# Altium project Main_board.PrjPcb
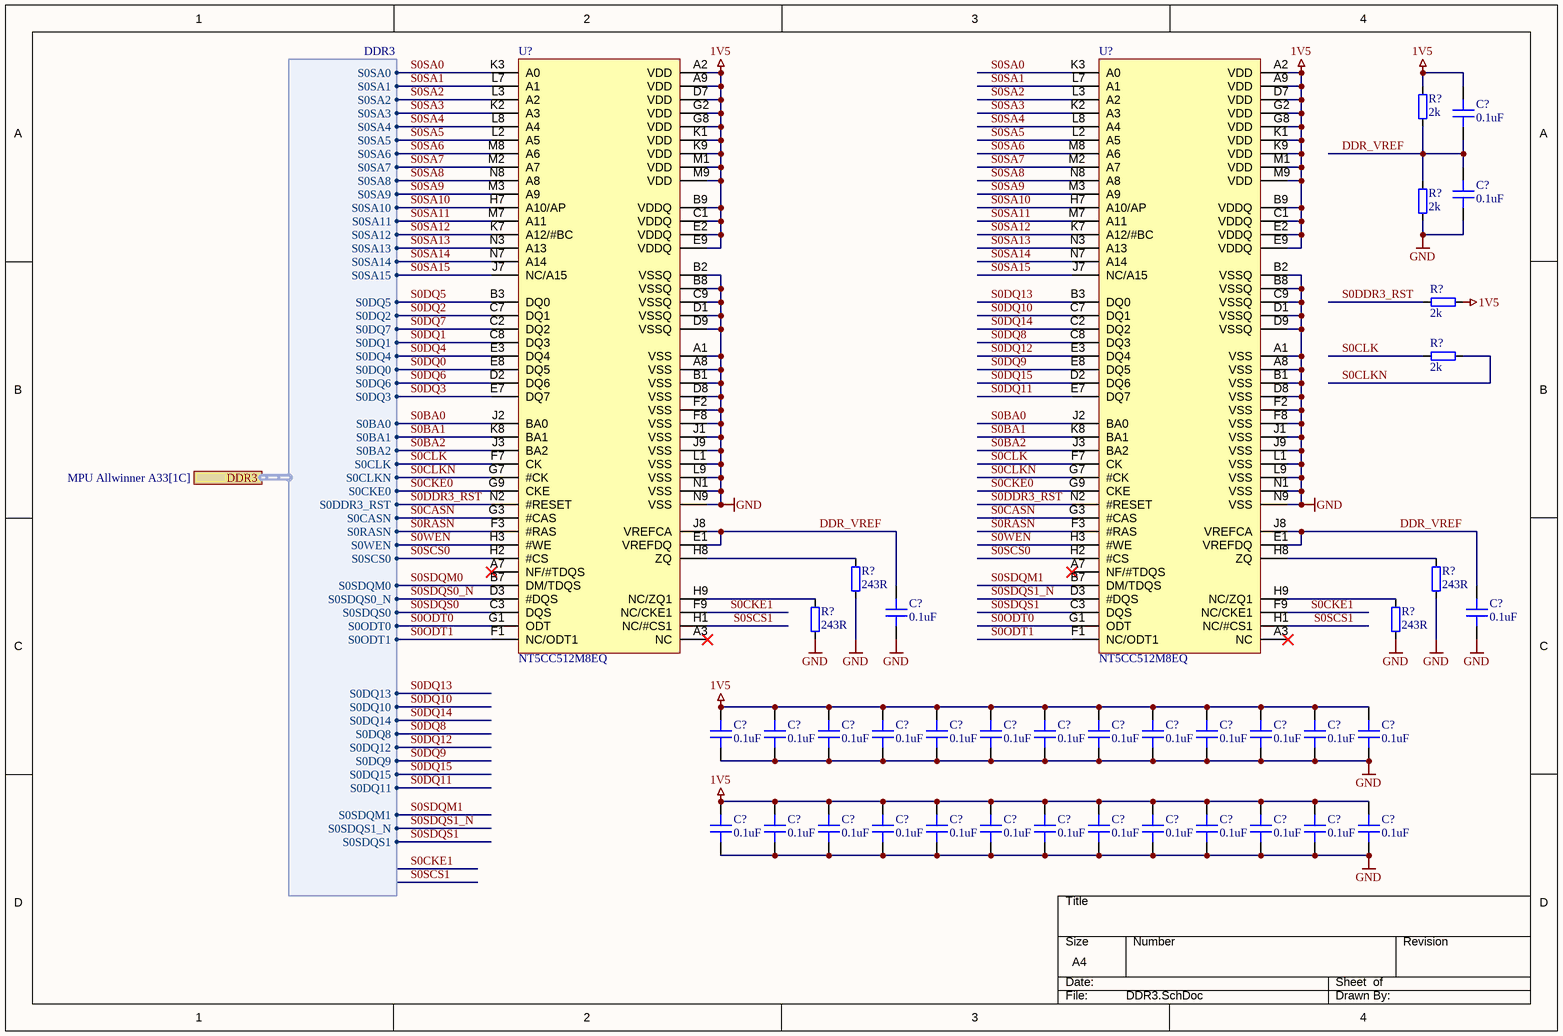
[diagram p0: DDR3.SchDoc]
11 sheets, 96 parts. Net scope: flat (ports and power ports of the same name join across sheets).
Board file: Main_board.PcbDoc
Sheets:
  Top level.SchDoc
  DDR3.SchDoc
  Micro SD.SchDoc
  NAND flash.SchDoc
  Wi-Fi AP6212.SchDoc
  PMIC AXP223.SchDoc
  CAN bus XL2515.SchDoc
  MPU Allwinner A33.SchDoc
  USB HUB FE1.1.SchDoc
  USB-Ethernet 100M SR9900A.SchDoc
  MCU HC32F460KETA.SchDoc

## Sheet Top level.SchDoc
size A4; SheetNumber: 5; SheetTotal: 5

## Sheet DDR3.SchDoc
size A4; SheetNumber: 3; SheetTotal: 9

### Parts
(Parts that share a designator on the sheet are numbered #1, #2 ... from top to bottom, then left to right.)
C?#1  0.1uF  [CAPC1005X06N]
C?#2  0.1uF  [CAPC1005X06N]
C?#3  0.1uF  [CAPC1005X06N]
C?#4  0.1uF  [CAPC1005X06N]
C?#5  0.1uF  [CAPC1005X06N]
C?#6  0.1uF  [CAPC1005X06N]
C?#7  0.1uF  [CAPC1005X06N]
C?#8  0.1uF  [CAPC1005X06N]
C?#9  0.1uF  [CAPC1005X06N]
C?#10  0.1uF  [CAPC1005X06N]
C?#11  0.1uF  [CAPC1005X06N]
C?#12  0.1uF  [CAPC1005X06N]
C?#13  0.1uF  [CAPC1005X06N]
C?#14  0.1uF  [CAPC1005X06N]
C?#15  0.1uF  [CAPC1005X06N]
C?#16  0.1uF  [CAPC1005X06N]
C?#17  0.1uF  [CAPC1005X06N]
C?#18  0.1uF  [CAPC1005X06N]
C?#19  0.1uF  [CAPC1005X06N]
C?#20  0.1uF  [CAPC1005X06N]
C?#21  0.1uF  [CAPC1005X06N]
C?#22  0.1uF  [CAPC1005X06N]
C?#23  0.1uF  [CAPC1005X06N]
C?#24  0.1uF  [CAPC1005X06N]
C?#25  0.1uF  [CAPC1005X06N]
C?#26  0.1uF  [CAPC1005X06N]
C?#27  0.1uF  [CAPC1005X06N]
C?#28  0.1uF  [CAPC1005X06N]
C?#29  0.1uF  [CAPC1005X06N]
C?#30  0.1uF  [CAPC1005X06N]
R?#1  2k  [RESC1005X35N]
R?#2  2k  [RESC1005X35N]
R?#3  2k  [RESC1005X35N]
R?#4  2k  [RESC1005X35N]
R?#5  243R  [RESC1005X35N]
R?#6  243R  [RESC1005X35N]
R?#7  243R  [RESC1005X35N]
R?#8  243R  [RESC1005X35N]
U?#1  NT5CC512M8EQ  [BGA78C80P9X13_800X1050X120]
U?#2  NT5CC512M8EQ  [BGA78C80P9X13_800X1050X120]

### Ports
DDR3 (harness DDR3, see MPU Allwinner A33[1C])

### Harnesses
DDR3: S0SA0, S0SA1, S0SA2, S0SA3, S0SA4, S0SA5, S0SA6, S0SA7, S0SA8, S0SA9, S0SA10, S0SA11, S0SA12, S0SA13, S0SA14, S0SA15, S0DQ5, S0DQ2, S0DQ7, S0DQ1, S0DQ4, S0DQ0, S0DQ6, S0DQ3, S0BA0, S0BA1, S0BA2, S0CLK, S0CLKN, S0CKE0, S0DDR3_RST, S0CASN, S0RASN, S0WEN, S0SCS0, S0SDQM0, S0SDQS0_N, S0SDQS0, S0ODT0, S0ODT1, S0DQ13, S0DQ10, S0DQ14, S0DQ8, S0DQ12, S0DQ9, S0DQ15, S0DQ11, S0SDQM1, S0SDQS1_N, S0SDQS1

### Nets
1V5: C?#1.1 C?#5.1 C?#6.1 C?#7.1 C?#8.1 C?#9.1 C?#10.1 C?#11.1 C?#12.1 C?#13.1 C?#14.1 C?#15.1 C?#16.1 C?#17.1 C?#18.1 C?#19.1 C?#20.1 C?#21.1 C?#22.1 C?#23.1 C?#24.1 C?#25.1 C?#26.1 C?#27.1 C?#28.1 C?#29.1 C?#30.1 R?#1.1 R?#3.2 U?#1.A2(VDD) U?#1.A9(VDD) U?#1.B9(VDDQ) U?#1.C1(VDDQ) U?#1.D7(VDD) U?#1.E2(VDDQ) U?#1.E9(VDDQ) U?#1.G2(VDD) U?#1.G8(VDD) U?#1.K1(VDD) U?#1.K9(VDD) U?#1.M1(VDD) U?#1.M9(VDD) U?#2.A2(VDD) U?#2.A9(VDD) U?#2.B9(VDDQ) U?#2.C1(VDDQ) U?#2.D7(VDD) U?#2.E2(VDDQ) U?#2.E9(VDDQ) U?#2.G2(VDD) U?#2.G8(VDD) U?#2.K1(VDD) U?#2.K9(VDD) U?#2.M1(VDD) U?#2.M9(VDD)
GND: C?#2.2 C?#3.2 C?#4.2 C?#5.2 C?#6.2 C?#7.2 C?#8.2 C?#9.2 C?#10.2 C?#11.2 C?#12.2 C?#13.2 C?#14.2 C?#15.2 C?#16.2 C?#17.2 C?#18.2 C?#19.2 C?#20.2 C?#21.2 C?#22.2 C?#23.2 C?#24.2 C?#25.2 C?#26.2 C?#27.2 C?#28.2 C?#29.2 C?#30.2 R?#2.2 R?#5.1 R?#6.1 R?#7.1 R?#8.1 U?#1.A1(VSS) U?#1.A8(VSS) U?#1.B1(VSS) U?#1.B2(VSSQ) U?#1.B8(VSSQ) U?#1.C9(VSSQ) U?#1.D1(VSSQ) U?#1.D8(VSS) U?#1.D9(VSSQ) U?#1.F2(VSS) U?#1.F8(VSS) U?#1.J1(VSS) U?#1.J9(VSS) U?#1.L1(VSS) U?#1.L9(VSS) U?#1.N1(VSS) U?#1.N9(VSS) U?#2.A1(VSS) U?#2.A8(VSS) U?#2.B1(VSS) U?#2.B2(VSSQ) U?#2.B8(VSSQ) U?#2.C9(VSSQ) U?#2.D1(VSSQ) U?#2.D8(VSS) U?#2.D9(VSSQ) U?#2.F2(VSS) U?#2.F8(VSS) U?#2.J1(VSS) U?#2.J9(VSS) U?#2.L1(VSS) U?#2.L9(VSS) U?#2.N1(VSS) U?#2.N9(VSS)
DDR_VREF: C?#1.2 C?#2.1 C?#3.1 C?#4.1 R?#1.2 R?#2.1 U?#1.E1(VREFDQ) U?#1.J8(VREFCA) U?#2.E1(VREFDQ) U?#2.J8(VREFCA)
S0BA0: U?#1.J2(BA0) U?#2.J2(BA0) ; port DDR3.S0BA0
S0BA1: U?#1.K8(BA1) U?#2.K8(BA1) ; port DDR3.S0BA1
S0BA2: U?#1.J3(BA2) U?#2.J3(BA2) ; port DDR3.S0BA2
S0CASN: U?#1.G3(#CAS) U?#2.G3(#CAS) ; port DDR3.S0CASN
S0CKE0: U?#1.G9(CKE) U?#2.G9(CKE) ; port DDR3.S0CKE0
S0CKE1: U?#1.F9(NC/CKE1) U?#2.F9(NC/CKE1)
S0CLK: R?#4.1 U?#1.F7(CK) U?#2.F7(CK) ; port DDR3.S0CLK
S0CLKN: R?#4.2 U?#1.G7(#CK) U?#2.G7(#CK) ; port DDR3.S0CLKN
S0DDR3_RST: R?#3.1 U?#1.N2(#RESET) U?#2.N2(#RESET) ; port DDR3.S0DDR3_RST
S0DQ0: U?#1.E8(DQ5) ; port DDR3.S0DQ0
S0DQ1: U?#1.C8(DQ3) ; port DDR3.S0DQ1
S0DQ2: U?#1.C7(DQ1) ; port DDR3.S0DQ2
S0DQ3: U?#1.E7(DQ7) ; port DDR3.S0DQ3
S0DQ4: U?#1.E3(DQ4) ; port DDR3.S0DQ4
S0DQ5: U?#1.B3(DQ0) ; port DDR3.S0DQ5
S0DQ6: U?#1.D2(DQ6) ; port DDR3.S0DQ6
S0DQ7: U?#1.C2(DQ2) ; port DDR3.S0DQ7
S0DQ8: U?#2.C8(DQ3) ; port DDR3.S0DQ8
S0DQ9: U?#2.E8(DQ5) ; port DDR3.S0DQ9
S0DQ10: U?#2.C7(DQ1) ; port DDR3.S0DQ10
S0DQ11: U?#2.E7(DQ7) ; port DDR3.S0DQ11
S0DQ12: U?#2.E3(DQ4) ; port DDR3.S0DQ12
S0DQ13: U?#2.B3(DQ0) ; port DDR3.S0DQ13
S0DQ14: U?#2.C2(DQ2) ; port DDR3.S0DQ14
S0DQ15: U?#2.D2(DQ6) ; port DDR3.S0DQ15
S0ODT0: U?#1.G1(ODT) U?#2.G1(ODT) ; port DDR3.S0ODT0
S0ODT1: U?#1.F1(NC/ODT1) U?#2.F1(NC/ODT1) ; port DDR3.S0ODT1
S0RASN: U?#1.F3(#RAS) U?#2.F3(#RAS) ; port DDR3.S0RASN
S0SA0: U?#1.K3(A0) U?#2.K3(A0) ; port DDR3.S0SA0
S0SA1: U?#1.L7(A1) U?#2.L7(A1) ; port DDR3.S0SA1
S0SA2: U?#1.L3(A2) U?#2.L3(A2) ; port DDR3.S0SA2
S0SA3: U?#1.K2(A3) U?#2.K2(A3) ; port DDR3.S0SA3
S0SA4: U?#1.L8(A4) U?#2.L8(A4) ; port DDR3.S0SA4
S0SA5: U?#1.L2(A5) U?#2.L2(A5) ; port DDR3.S0SA5
S0SA6: U?#1.M8(A6) U?#2.M8(A6) ; port DDR3.S0SA6
S0SA7: U?#1.M2(A7) U?#2.M2(A7) ; port DDR3.S0SA7
S0SA8: U?#1.N8(A8) U?#2.N8(A8) ; port DDR3.S0SA8
S0SA9: U?#1.M3(A9) U?#2.M3(A9) ; port DDR3.S0SA9
S0SA10: U?#1.H7(A10/AP) U?#2.H7(A10/AP) ; port DDR3.S0SA10
S0SA11: U?#1.M7(A11) U?#2.M7(A11) ; port DDR3.S0SA11
S0SA12: U?#1.K7(A12/#BC) U?#2.K7(A12/#BC) ; port DDR3.S0SA12
S0SA13: U?#1.N3(A13) U?#2.N3(A13) ; port DDR3.S0SA13
S0SA14: U?#1.N7(A14) U?#2.N7(A14) ; port DDR3.S0SA14
S0SA15: U?#1.J7(NC/A15) U?#2.J7(NC/A15) ; port DDR3.S0SA15
S0SCS0: U?#1.H2(#CS) U?#2.H2(#CS) ; port DDR3.S0SCS0
S0SCS1: U?#1.H1(NC/#CS1) U?#2.H1(NC/#CS1)
S0SDQM0: U?#1.B7(DM/TDQS) ; port DDR3.S0SDQM0
S0SDQM1: U?#2.B7(DM/TDQS) ; port DDR3.S0SDQM1
S0SDQS0: U?#1.C3(DQS) ; port DDR3.S0SDQS0
S0SDQS0_N: U?#1.D3(#DQS) ; port DDR3.S0SDQS0_N
S0SDQS1: U?#2.C3(DQS) ; port DDR3.S0SDQS1
S0SDQS1_N: U?#2.D3(#DQS) ; port DDR3.S0SDQS1_N
S0WEN: U?#1.H3(#WE) U?#2.H3(#WE) ; port DDR3.S0WEN
NetR?#5_2: R?#5.2 U?#1.H8(ZQ)
NetR?#6_2: R?#6.2 U?#2.H8(ZQ)
NetR?#7_2: R?#7.2 U?#1.H9(NC/ZQ1)
NetR?#8_2: R?#8.2 U?#2.H9(NC/ZQ1)

Not connected (* = marked no-connect by the designer): U?#1 A3(NC)* A7(NF/#TDQS)*; U?#2 A3(NC)* A7(NF/#TDQS)*

### Notes on the sheet
- THIS DOCUMENT AND THE DATA DISCLOSED HEREIN OR
- HEREWITH IS THE PROPERTY OF ALTIUM LIMITED AND MAY
- DWG NO:
- REVISION
- REV:
- DESCRIPTION
- DATE
- APPROVED
- BE FREELY DISTRIBUTED IN WHOLE. NO RIGHTS ARE
- RESERVED OR EXPRESS OR IMPLIED WARANTEE GIVEN.
- ENG:
- APPROVALS
- PROJECT
- DSN:
- CHK:
- REFERENCE DOCUMENTS
- PROJECT REVISION:
- TITLE
- DOCUMENT REVISION:
- DESIGN ITEM:
- BOM:
- FAB DWG:
- PCB DWG:
- ASSY DWG:
- SCALE:
- A3
- SIZE
- CAGE CODE
- FILE NAME
- DWG NO.
- SHEET
- OF
- REV

### Library data of the parts
C?#1-C?#30 = 0402B104K500CT: Manufacturer: Walsin Tech Corp; Voltage: 50V; Tolerance: 10%; Dielectric: X7R; Min Temperature: -55; Max Temperature: 125; Part Number: 0402B104K500CT; ComponentLink1URL: https://datasheet.lcsc.com/lcsc/1810191621_Walsin-Tech-Corp-0402B104K500CT_C152814.pdf; ComponentLink1Description: Datasheet; Package: 0402; Part Status: Active; Capacitance: 0.1uF
R?#1-R?#4 = WR04X2001FTL: Resistor; Manufacturer: Walsin Tech Corp; Tolerance: 1%; Power: 1/16 W; Temperature Coefficient: 100ppm; Min Temperature: -55°C; Max Temperature: 155°C; Part Number: WR04X2001FTL; ComponentLink1URL: https://datasheet.lcsc.com/lcsc/1810191630_Walsin-Tech-Corp-WR04X2001FTL_C163822.pdf; ComponentLink1Description: Datasheet; Package: 0402; Part Status: Active; Resistance: 2k
R?#5-R?#8 = FRC0402F2430TS: Resistor; Manufacturer: FOJAN; Tolerance: 1%; Power: 1/16 W; Temperature Coefficient: 100ppm; Min Temperature: -55°C; Max Temperature: 155°C; Part Number: FRC0402F2430TS; ComponentLink1URL: https://datasheet.lcsc.com/lcsc/2201121430_FOJAN-FRC0402F2430TS_C2929995.pdf; ComponentLink1Description: Datasheet; Package: 0402; Part Status: Active; Resistance: 243R
U?#1 U?#2 = NT5CC512M8EQ: DDR3-1600, TFBGA-78; MANUFACTURER: Nanya Technology Cooperation; Part Number: NT5CC512M8EQ; COMPONENTLINK1URL: https://datasheet.lcsc.com/szlcsc/1912111437_Nanya-Tech-NT5CC256M16ER-EK_C428584.pdf; COMPONENTLINK1DESCRIPTION: Datasheet; PACKAGE: FBGA-78; Part Status: Active

## Sheet Micro SD.SchDoc
size A4; SheetNumber: 4; SheetTotal: 12
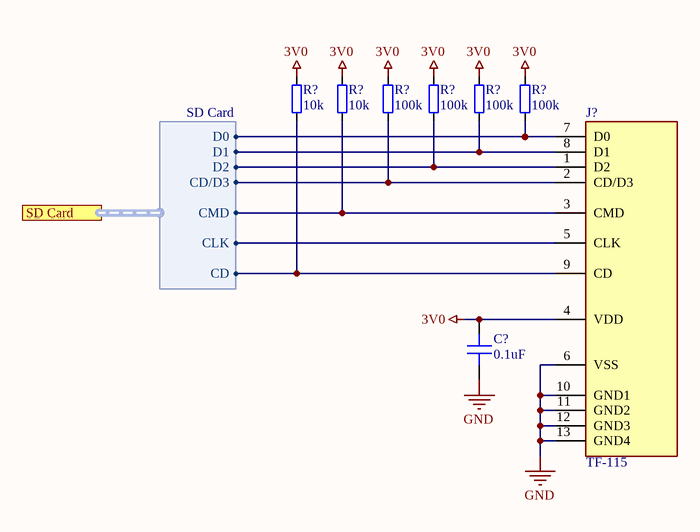
[diagram p1: Micro SD.SchDoc]

### Parts
(Parts that share a designator on the sheet are numbered #1, #2 ... from top to bottom, then left to right.)
C?#31  0.1uF  [CAPC1005X06N]
J?  TF-115  [TF-115]
R?#9  10k  [RESC1005X35N]
R?#10  10k  [RESC1005X35N]
R?#11  100k  [RESC1005X35N]
R?#12  100k  [RESC1005X35N]
R?#13  100k  [RESC1005X35N]
R?#14  100k  [RESC1005X35N]

### Ports
SD Card (harness SD Card)

### Harnesses
SD Card: D0, D1, D2, CD/D3, CMD, CLK, CD

### Nets
3V0: C?#31.2 J?.4(VDD) R?#9.1 R?#10.2 R?#11.2 R?#12.2 R?#13.2 R?#14.2
GND: C?#31.1 J?.6(VSS) J?.10(GND1) J?.11(GND2) J?.12(GND3) J?.13(GND4)
NetJ?_1: J?.1(D2) R?#12.1 ; port SD Card.D2
NetJ?_2: J?.2(CD/D3) R?#11.1 ; port SD Card.CD/D3
NetJ?_3: J?.3(CMD) R?#10.1 ; port SD Card.CMD
NetJ?_5: J?.5(CLK) ; port SD Card.CLK
NetJ?_7: J?.7(D0) R?#14.1 ; port SD Card.D0
NetJ?_8: J?.8(D1) R?#13.1 ; port SD Card.D1
NetJ?_9: J?.9(CD) R?#9.2 ; port SD Card.CD

### Library data of the parts
C?#31 = 0402B104K500CT: as C?#1 on sheet DDR3; Part Number: 0402B104K500CT; ComponentLink1URL: https://datasheet.lcsc.com/lcsc/1810191621_Walsin-Tech-Corp-0402B104K500CT_C152814.pdf; ComponentLink1Description: Datasheet; Package: 0402; Part Status: Active; Capacitance: 0.1uF
J? = TF-115: Micro-SD card holder; MANUFACTURER: XUNPU; Part Number: TF-115; COMPONENTLINK1URL: https://datasheet.lcsc.com/lcsc/2109061830_XUNPU-TF-115_C266620.pdf; COMPONENTLINK1DESCRIPTION: Datasheet; PACKAGE: SMD; Part Status: Active
R?#9 R?#10 = WR04X1002FTL: Resistor; Manufacturer: Walsin Tech Corp; Tolerance: 1%; Power: 1/16 W; Temperature Coefficient: 100ppm; Min Temperature: -55°C; Max Temperature: 155°C; Part Number: WR04X1002FTL; ComponentLink1URL: https://datasheet.lcsc.com/lcsc/2304140030_Walsin-Tech-Corp-WR04X1002FTL_C163810.pdf; ComponentLink1Description: Datasheet; Package: 0402; Part Status: Active; Resistance: 10k
R?#11-R?#14 = WR04X1003FTL: Resistor; Manufacturer: Walsin Tech Corp; Tolerance: 1%; Power: 1/16 W; Temperature Coefficient: 100ppm; Min Temperature: -55°C; Max Temperature: 155°C; Part Number: WR04X1003FTL; ComponentLink1URL: https://datasheet.lcsc.com/lcsc/2304140030_Walsin-Tech-Corp-WR04X1003FTL_C163806.pdf; ComponentLink1Description: Datasheet; Package: 0402; Part Status: Active; Resistance: 100k

## Sheet NAND flash.SchDoc
size A4; SheetNumber: 5; SheetTotal: 9
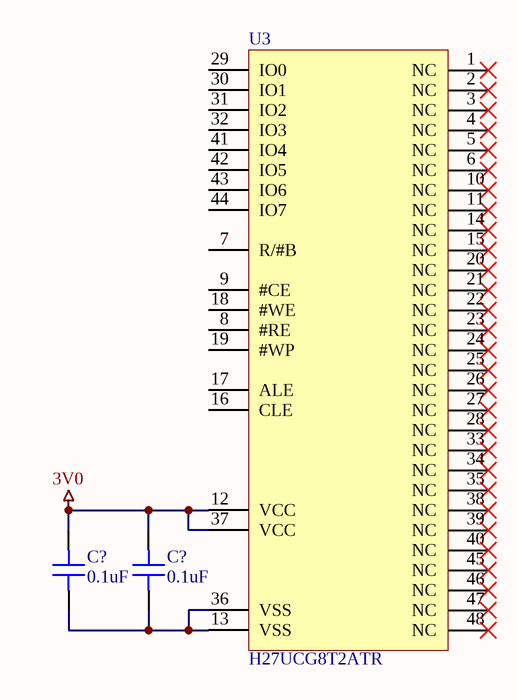
[diagram p2: NAND flash.SchDoc]

### Parts
(Parts that share a designator on the sheet are numbered #1, #2 ... from top to bottom, then left to right.)
C?#32  0.1uF  [CAPC1005X06N]
C?#33  0.1uF  [CAPC1005X06N]
U3  H27UCG8T2ATR  [TSSOP50P2000X120-48N]

### Nets
3V0: C?#32.1 C?#33.1 U3.12(VCC) U3.37(VCC)
NetC?#32_2: C?#32.2 C?#33.2 U3.13(VSS) U3.36(VSS)

Not connected (* = marked no-connect by the designer): U3 1(NC)* 2(NC)* 3(NC)* 4(NC)* 5(NC)* 6(NC)* 7(R/#B) 8(#RE) 9(#CE) 10(NC)* 11(NC)* 14(NC)* 15(NC)* 16(CLE) 17(ALE) 18(#WE) 19(#WP) 20(NC)* 21(NC)* 22(NC)* 23(NC)* 24(NC)* 25(NC)* 26(NC)* 27(NC)* 28(NC)* 29(IO0) 30(IO1) 31(IO2) 32(IO3) 33(NC)* 34(NC)* 35(NC)* 38(NC)* 39(NC)* 40(NC)* 41(IO4) 42(IO5) 43(IO6) 44(IO7) 45(NC)* 46(NC)* 47(NC)* 48(NC)*

### Library data of the parts
C?#32 C?#33 = 0402B104K500CT: as C?#1 on sheet DDR3; Part Number: 0402B104K500CT; ComponentLink1URL: https://datasheet.lcsc.com/lcsc/1810191621_Walsin-Tech-Corp-0402B104K500CT_C152814.pdf; ComponentLink1Description: Datasheet; Package: 0402; Part Status: Active; Capacitance: 0.1uF
U3 = H27UCG8T2ATR: NAND Flash Memory; MANUFACTURER: SK Hynix; Part Number: H27UCG8T2ATR; COMPONENTLINK1URL: https://z3d9b7u8.stackpathcdn.com/pdf-down/H/2/7/H27UCG8T2ATR-BC-Hynix.pdf; COMPONENTLINK1DESCRIPTION: Datasheet; PACKAGE: TSSOP-48; Part Status: Active

## Sheet Wi-Fi AP6212.SchDoc
size A4; SheetNumber: 6; SheetTotal: 6

## Sheet PMIC AXP223.SchDoc
size A4; SheetNumber: 7; SheetTotal: 7

## Sheet CAN bus XL2515.SchDoc
size A4; SheetNumber: 8; SheetTotal: 9
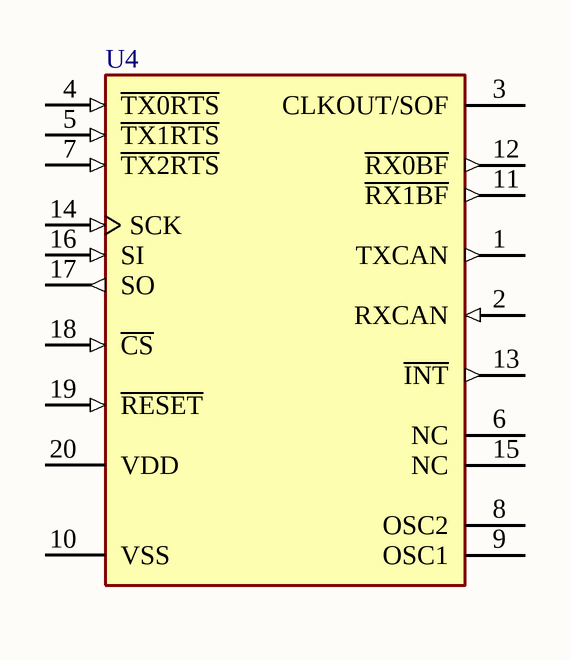
[diagram p3: CAN bus XL2515.SchDoc]

### Parts
U4  (no value)  [TSOP65P640X110-20N]

### Nets

Not connected (* = marked no-connect by the designer): U4 1(TXCAN) 2(RXCAN) 3(CLKOUT/SOF) 4(~{TX0RTS}) 5(~{TX1RTS}) 6(NC) 7(~{TX2RTS}) 8(OSC2) 9(OSC1) 10(VSS) 11(~{RX1BF}) 12(~{RX0BF}) 13(~{INT}) 14(SCK) 15(NC) 16(SI) 17(SO) 18(~{CS}) 19(~{RESET}) 20(VDD)

### Library data of the parts
U4 = XL2515-TSS: IC CAN CTLR W/SPI 2.0B 20-QFN; Manufacturer: XINLUDA; Part Number: XL2515-TSS; ComponentLink1URL: https://datasheet.lcsc.com/lcsc/2012081507_XINLUDA-XL2515-TSS_C609745.pdf; ComponentLink1Description: Datasheet; Package: TSSOP-20; Part Status: Active

## Sheet MPU Allwinner A33.SchDoc
size A2; SheetNumber: 9; SheetTotal: 9
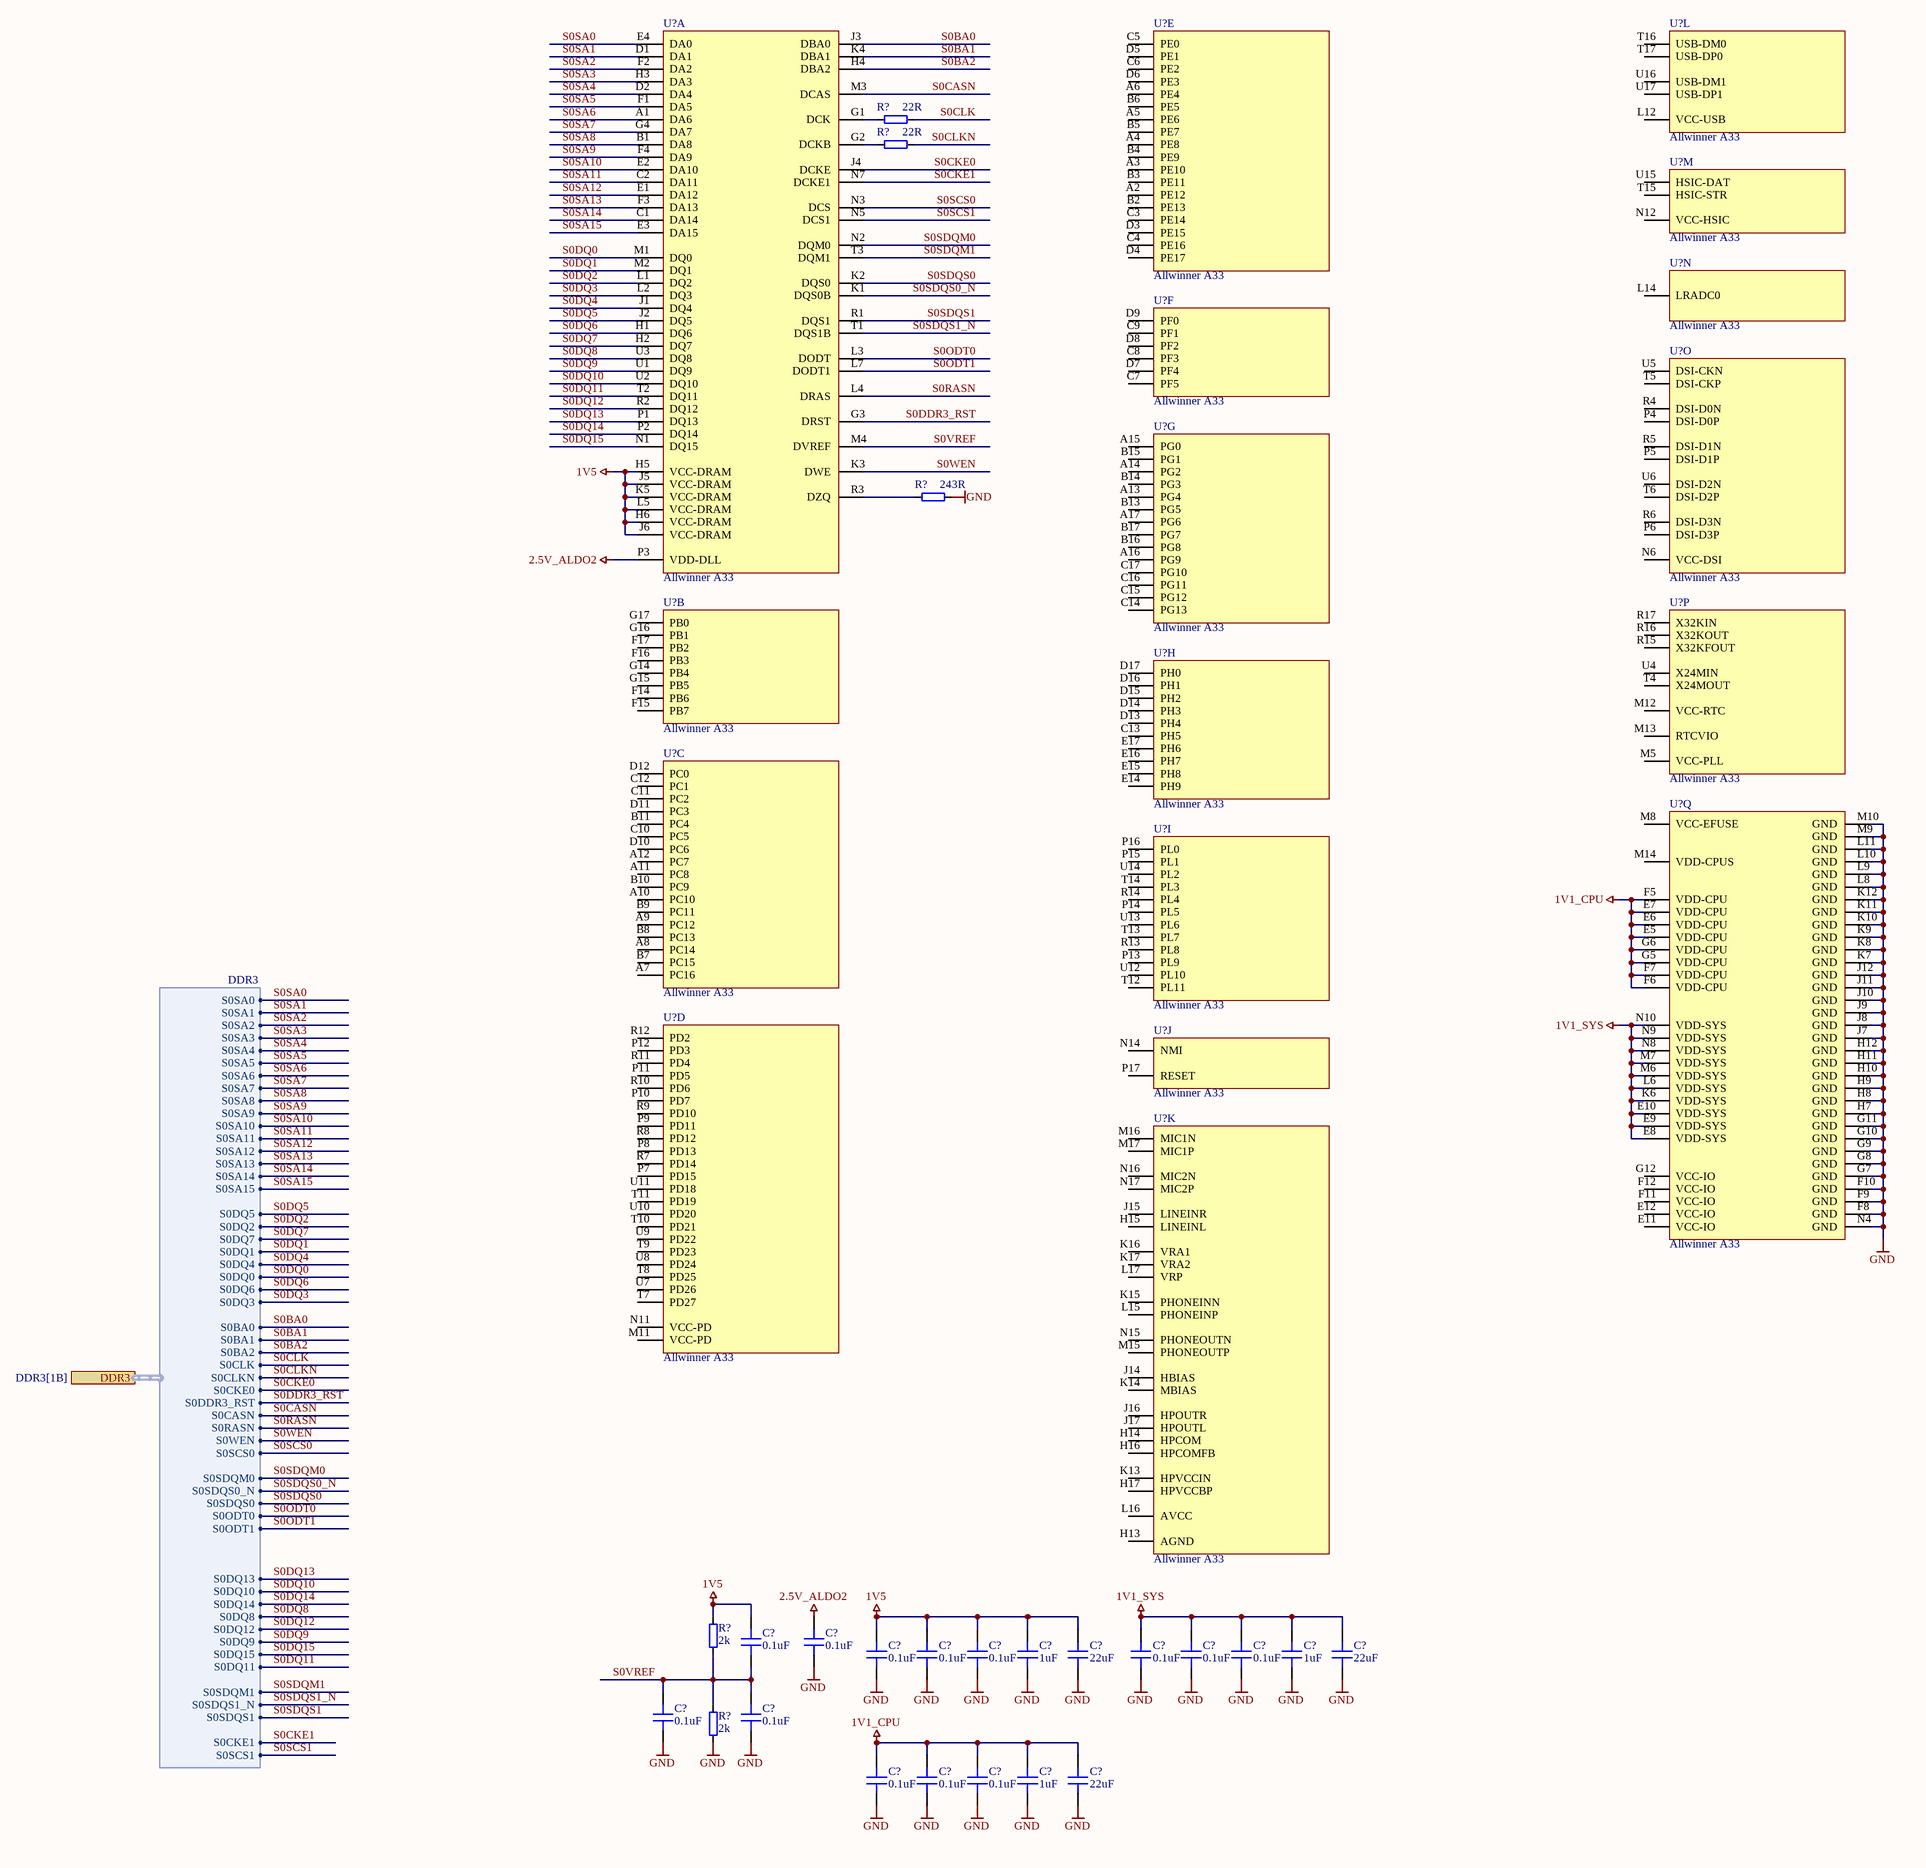
[diagram p4: MPU Allwinner A33.SchDoc]

### Parts
(Parts that share a designator on the sheet are numbered #1, #2 ... from top to bottom, then left to right.)
C?#34  0.1uF  [CAPC1005X06N]
C?#35  0.1uF  [CAPC1005X06N]
C?#36  0.1uF  [CAPC1005X06N]
C?#37  0.1uF  [CAPC1005X06N]
C?#38  0.1uF  [CAPC1005X06N]
C?#39  1uF  [CAPC1608X09N]
C?#40  22uF  [CAPC3216X16N]
C?#41  0.1uF  [CAPC1005X06N]
C?#42  0.1uF  [CAPC1005X06N]
C?#43  0.1uF  [CAPC1005X06N]
C?#44  1uF  [CAPC1608X09N]
C?#45  22uF  [CAPC3216X16N]
C?#46  0.1uF  [CAPC1005X06N]
C?#47  0.1uF  [CAPC1005X06N]
C?#48  0.1uF  [CAPC1005X06N]
C?#49  0.1uF  [CAPC1005X06N]
C?#50  0.1uF  [CAPC1005X06N]
C?#51  1uF  [CAPC1608X09N]
C?#52  22uF  [CAPC3216X16N]
R?#15  22R  [RESC1005X35N]
R?#16  22R  [RESC1005X35N]
R?#17  243R  [RESC1005X35N]
R?#18  2k  [RESC1005X35N]
R?#19  2k  [RESC1005X35N]
U?#3  Allwinner A33  [BGA282C80P17X17_1400X1400X130(Allwinner A33)]  (part L of 17)
U?#4  Allwinner A33  [BGA282C80P17X17_1400X1400X130(Allwinner A33)]  (part E of 17)
U?#5  Allwinner A33  [BGA282C80P17X17_1400X1400X130(Allwinner A33)]  (part M of 17)
U?#6  Allwinner A33  [BGA282C80P17X17_1400X1400X130(Allwinner A33)]  (part N of 17)
U?#7  Allwinner A33  [BGA282C80P17X17_1400X1400X130(Allwinner A33)]  (part A of 17)
U?#8  Allwinner A33  [BGA282C80P17X17_1400X1400X130(Allwinner A33)]  (part F of 17)
U?#9  Allwinner A33  [BGA282C80P17X17_1400X1400X130(Allwinner A33)]  (part O of 17)
U?#10  Allwinner A33  [BGA282C80P17X17_1400X1400X130(Allwinner A33)]  (part G of 17)
U?#11  Allwinner A33  [BGA282C80P17X17_1400X1400X130(Allwinner A33)]  (part B of 17)
U?#12  Allwinner A33  [BGA282C80P17X17_1400X1400X130(Allwinner A33)]  (part P of 17)
U?#13  Allwinner A33  [BGA282C80P17X17_1400X1400X130(Allwinner A33)]  (part H of 17)
U?#14  Allwinner A33  [BGA282C80P17X17_1400X1400X130(Allwinner A33)]  (part C of 17)
U?#15  Allwinner A33  [BGA282C80P17X17_1400X1400X130(Allwinner A33)]  (part I of 17)
U?#16  Allwinner A33  [BGA282C80P17X17_1400X1400X130(Allwinner A33)]  (part Q of 17)
U?#17  Allwinner A33  [BGA282C80P17X17_1400X1400X130(Allwinner A33)]  (part J of 17)
U?#18  Allwinner A33  [BGA282C80P17X17_1400X1400X130(Allwinner A33)]  (part D of 17)
U?#19  Allwinner A33  [BGA282C80P17X17_1400X1400X130(Allwinner A33)]  (part K of 17)

### Ports
DDR3 (harness DDR3, see DDR3[1B])

### Harnesses
DDR3: S0SA0, S0SA1, S0SA2, S0SA3, S0SA4, S0SA5, S0SA6, S0SA7, S0SA8, S0SA9, S0SA10, S0SA11, S0SA12, S0SA13, S0SA14, S0SA15, S0DQ5, S0DQ2, S0DQ7, S0DQ1, S0DQ4, S0DQ0, S0DQ6, S0DQ3, S0BA0, S0BA1, S0BA2, S0CLK, S0CLKN, S0CKE0, S0DDR3_RST, S0CASN, S0RASN, S0WEN, S0SCS0, S0SDQM0, S0SDQS0_N, S0SDQS0, S0ODT0, S0ODT1, S0DQ13, S0DQ10, S0DQ14, S0DQ8, S0DQ12, S0DQ9, S0DQ15, S0DQ11, S0SDQM1, S0SDQS1_N, S0SDQS1, S0CKE1, S0SCS1

### Nets
1V1_CPU: C?#48.1 C?#49.1 C?#50.1 C?#51.1 C?#52.2 U?#16.E5(VDD-CPU) U?#16.E6(VDD-CPU) U?#16.E7(VDD-CPU) U?#16.F5(VDD-CPU) U?#16.F6(VDD-CPU) U?#16.F7(VDD-CPU) U?#16.G5(VDD-CPU) U?#16.G6(VDD-CPU)
1V1_SYS: C?#41.1 C?#42.1 C?#43.1 C?#44.1 C?#45.2 U?#16.E8(VDD-SYS) U?#16.E9(VDD-SYS) U?#16.E10(VDD-SYS) U?#16.K6(VDD-SYS) U?#16.L6(VDD-SYS) U?#16.M6(VDD-SYS) U?#16.M7(VDD-SYS) U?#16.N8(VDD-SYS) U?#16.N9(VDD-SYS) U?#16.N10(VDD-SYS)
1V5: C?#34.1 C?#36.1 C?#37.1 C?#38.1 C?#39.1 C?#40.2 R?#18.1 U?#7.H5(VCC-DRAM) U?#7.H6(VCC-DRAM) U?#7.J5(VCC-DRAM) U?#7.J6(VCC-DRAM) U?#7.K5(VCC-DRAM) U?#7.L5(VCC-DRAM)
2.5V_ALDO2: C?#35.1 U?#7.P3(VDD-DLL)
GND: C?#35.2 C?#36.2 C?#37.2 C?#38.2 C?#39.2 C?#40.1 C?#41.2 C?#42.2 C?#43.2 C?#44.2 C?#45.1 C?#46.2 C?#47.2 C?#48.2 C?#49.2 C?#50.2 C?#51.2 C?#52.1 R?#17.1 R?#19.2 U?#16.F8(GND) U?#16.F9(GND) U?#16.F10(GND) U?#16.G7(GND) U?#16.G8(GND) U?#16.G9(GND) U?#16.G10(GND) U?#16.G11(GND) U?#16.H7(GND) U?#16.H8(GND) U?#16.H9(GND) U?#16.H10(GND) U?#16.H11(GND) U?#16.H12(GND) U?#16.J7(GND) U?#16.J8(GND) U?#16.J9(GND) U?#16.J10(GND) U?#16.J11(GND) U?#16.J12(GND) U?#16.K7(GND) U?#16.K8(GND) U?#16.K9(GND) U?#16.K10(GND) U?#16.K11(GND) U?#16.K12(GND) U?#16.L8(GND) U?#16.L9(GND) U?#16.L10(GND) U?#16.L11(GND) U?#16.M9(GND) U?#16.M10(GND) U?#16.N4(GND)
S0BA0: U?#7.J3(DBA0) ; port DDR3.S0BA0
S0BA1: U?#7.K4(DBA1) ; port DDR3.S0BA1
S0BA2: U?#7.H4(DBA2) ; port DDR3.S0BA2
S0CASN: U?#7.M3(DCAS) ; port DDR3.S0CASN
S0CKE0: U?#7.J4(DCKE) ; port DDR3.S0CKE0
S0CKE1: U?#7.N7(DCKE1) ; port DDR3.S0CKE1
S0CLK: R?#15.1 ; port DDR3.S0CLK
S0CLKN: R?#16.1 ; port DDR3.S0CLKN
S0DDR3_RST: U?#7.G3(DRST) ; port DDR3.S0DDR3_RST
S0DQ0: U?#7.M1(DQ0) ; port DDR3.S0DQ0
S0DQ1: U?#7.M2(DQ1) ; port DDR3.S0DQ1
S0DQ2: U?#7.L1(DQ2) ; port DDR3.S0DQ2
S0DQ3: U?#7.L2(DQ3) ; port DDR3.S0DQ3
S0DQ4: U?#7.J1(DQ4) ; port DDR3.S0DQ4
S0DQ5: U?#7.J2(DQ5) ; port DDR3.S0DQ5
S0DQ6: U?#7.H1(DQ6) ; port DDR3.S0DQ6
S0DQ7: U?#7.H2(DQ7) ; port DDR3.S0DQ7
S0DQ8: U?#7.U3(DQ8) ; port DDR3.S0DQ8
S0DQ9: U?#7.U1(DQ9) ; port DDR3.S0DQ9
S0DQ10: U?#7.U2(DQ10) ; port DDR3.S0DQ10
S0DQ11: U?#7.T2(DQ11) ; port DDR3.S0DQ11
S0DQ12: U?#7.R2(DQ12) ; port DDR3.S0DQ12
S0DQ13: U?#7.P1(DQ13) ; port DDR3.S0DQ13
S0DQ14: U?#7.P2(DQ14) ; port DDR3.S0DQ14
S0DQ15: U?#7.N1(DQ15) ; port DDR3.S0DQ15
S0ODT0: U?#7.L3(DODT) ; port DDR3.S0ODT0
S0ODT1: U?#7.L7(DODT1) ; port DDR3.S0ODT1
S0RASN: U?#7.L4(DRAS) ; port DDR3.S0RASN
S0SA0: U?#7.E4(DA0) ; port DDR3.S0SA0
S0SA1: U?#7.D1(DA1) ; port DDR3.S0SA1
S0SA2: U?#7.F2(DA2) ; port DDR3.S0SA2
S0SA3: U?#7.H3(DA3) ; port DDR3.S0SA3
S0SA4: U?#7.D2(DA4) ; port DDR3.S0SA4
S0SA5: U?#7.F1(DA5) ; port DDR3.S0SA5
S0SA6: U?#7.A1(DA6) ; port DDR3.S0SA6
S0SA7: U?#7.G4(DA7) ; port DDR3.S0SA7
S0SA8: U?#7.B1(DA8) ; port DDR3.S0SA8
S0SA9: U?#7.F4(DA9) ; port DDR3.S0SA9
S0SA10: U?#7.E2(DA10) ; port DDR3.S0SA10
S0SA11: U?#7.C2(DA11) ; port DDR3.S0SA11
S0SA12: U?#7.E1(DA12) ; port DDR3.S0SA12
S0SA13: U?#7.F3(DA13) ; port DDR3.S0SA13
S0SA14: U?#7.C1(DA14) ; port DDR3.S0SA14
S0SA15: U?#7.E3(DA15) ; port DDR3.S0SA15
S0SCS0: U?#7.N3(DCS) ; port DDR3.S0SCS0
S0SCS1: U?#7.N5(DCS1) ; port DDR3.S0SCS1
S0SDQM0: U?#7.N2(DQM0) ; port DDR3.S0SDQM0
S0SDQM1: U?#7.T3(DQM1) ; port DDR3.S0SDQM1
S0SDQS0: U?#7.K2(DQS0) ; port DDR3.S0SDQS0
S0SDQS0_N: U?#7.K1(DQS0B) ; port DDR3.S0SDQS0_N
S0SDQS1: U?#7.R1(DQS1) ; port DDR3.S0SDQS1
S0SDQS1_N: U?#7.T1(DQS1B) ; port DDR3.S0SDQS1_N
S0VREF: C?#34.2 C?#46.1 C?#47.1 R?#18.2 R?#19.1 U?#7.M4(DVREF)
S0WEN: U?#7.K3(DWE) ; port DDR3.S0WEN
NetR?#15_2: R?#15.2 U?#7.G1(DCK)
NetR?#16_2: R?#16.2 U?#7.G2(DCKB)
NetR?#17_2: R?#17.2 U?#7.R3(DZQ)

Not connected (* = marked no-connect by the designer): U?#3 L12(VCC-USB) T16(USB-DM0) T17(USB-DP0) U16(USB-DM1) U17(USB-DP1); U?#4 A2(PE12) A3(PE10) A4(PE8) A5(PE6) A6(PE4) B2(PE13) B3(PE11) B4(PE9) B5(PE7) B6(PE5) C3(PE14) C4(PE16) C5(PE0) C6(PE2) D3(PE15) D4(PE17) D5(PE1) D6(PE3); U?#5 N12(VCC-HSIC) T15(HSIC-STR) U15(HSIC-DAT); U?#6 L14(LRADC0); U?#8 C7(PF5) C8(PF3) C9(PF1) D7(PF4) D8(PF2) D9(PF0); U?#9 N6(VCC-DSI) P4(DSI-D0P) P5(DSI-D1P) P6(DSI-D3P) R4(DSI-D0N) R5(DSI-D1N) R6(DSI-D3N) T5(DSI-CKP) T6(DSI-D2P) U5(DSI-CKN) U6(DSI-D2N); U?#10 A13(PG4) A14(PG2) A15(PG0) A16(PG9) A17(PG6) B13(PG5) B14(PG3) B15(PG1) B16(PG8) B17(PG7) C14(PG13) C15(PG12) C16(PG11) C17(PG10); U?#11 F14(PB6) F15(PB7) F16(PB3) F17(PB2) G14(PB4) G15(PB5) G16(PB1) G17(PB0); U?#12 M5(VCC-PLL) M12(VCC-RTC) M13(RTCVIO) R15(X32KFOUT) R16(X32KOUT) R17(X32KIN) T4(X24MOUT) U4(X24MIN); U?#13 C13(PH5) D13(PH4) D14(PH3) D15(PH2) D16(PH1) D17(PH0) E14(PH9) E15(PH8) E16(PH7) E17(PH6); U?#14 A7(PC16) A8(PC14) A9(PC12) A10(PC10) A11(PC8) A12(PC7) B7(PC15) B8(PC13) B9(PC11) B10(PC9) B11(PC4) C10(PC5) C11(PC2) C12(PC1) D10(PC6) D11(PC3) D12(PC0); U?#15 P13(PL9) P14(PL5) P15(PL1) P16(PL0) R13(PL8) R14(PL4) T12(PL11) T13(PL7) T14(PL3) U12(PL10) U13(PL6) U14(PL2); U?#16 E11(VCC-IO) E12(VCC-IO) F11(VCC-IO) F12(VCC-IO) G12(VCC-IO) M8(VCC-EFUSE) M14(VDD-CPUS); U?#17 N14(NMI) P17(RESET); U?#18 M11(VCC-PD) N11(VCC-PD) P7(PD15) P8(PD13) P9(PD11) P10(PD7) P11(PD5) P12(PD3) R7(PD14) R8(PD12) R9(PD10) R10(PD6) R11(PD4) R12(PD2) T7(PD27) T8(PD25) T9(PD23) T10(PD21) T11(PD19) U7(PD26) U8(PD24) U9(PD22) U10(PD20) U11(PD18); U?#19 H13(AGND) H14(HPCOM) H15(LINEINL) H16(HPCOMFB) H17(HPVCCBP) J14(HBIAS) J15(LINEINR) J16(HPOUTR) J17(HPOUTL) K13(HPVCCIN) K14(MBIAS) K15(PHONEINN) K16(VRA1) K17(VRA2) L15(PHONEINP) L16(AVCC) L17(VRP) M15(PHONEOUTP) M16(MIC1N) M17(MIC1P) N15(PHONEOUTN) N16(MIC2N) N17(MIC2P)

### Library data of the parts
C?#34-C?#38 C?#41-C?#43 C?#46-C?#50 = 0402B104K500CT: as C?#1 on sheet DDR3; Part Number: 0402B104K500CT; ComponentLink1URL: https://datasheet.lcsc.com/lcsc/1810191621_Walsin-Tech-Corp-0402B104K500CT_C152814.pdf; ComponentLink1Description: Datasheet; Package: 0402; Part Status: Active; Capacitance: 0.1uF
C?#39 C?#44 C?#51 = 0603B105K160CT: Manufacturer: Walsin Tech Corp; Voltage: 16V; Tolerance: 10%; Dielectric: X7R; Min Temperature: -55; Max Temperature: 125; Part Number: 0603B105K160CT; ComponentLink1URL: https://datasheet.lcsc.com/lcsc/1811151141_Walsin-Tech-Corp-0603B105K160CT_C108463.pdf; ComponentLink1Description: Datasheet; Package: 0603; Part Status: Active; Capacitance: 1uF
C?#40 C?#45 C?#52 = 1206B226K100CT: Manufacturer: Walsin Tech Corp; Voltage: 10V; Tolerance: 10%; Dielectric: X7R; Min Temperature: -55; Max Temperature: 125; Part Number: 1206B226K100CT; ComponentLink1URL: https://datasheet.lcsc.com/lcsc/2209151800_Walsin-Tech-Corp-1206B226K100CT_C237195.pdf; ComponentLink1Description: Datasheet; Package: 1206; Part Status: Active; Capacitance: 22uF
R?#15 R?#16 = FRC0402F22R0TS: Resistor; Manufacturer: FOJAN; Tolerance: 1%; Power: 1/16 W; Temperature Coefficient: 100ppm; Min Temperature: -55°C; Max Temperature: 155°C; Part Number: FRC0402F22R0TS; ComponentLink1URL: https://datasheet.lcsc.com/lcsc/2201121430_FOJAN-FRC0402F22R0TS_C2929994.pdf; ComponentLink1Description: Datasheet; Package: 0402; Part Status: Active; Resistance: 22R
R?#17 = FRC0402F2430TS: as R?#5 on sheet DDR3; Part Number: FRC0402F2430TS; ComponentLink1URL: https://datasheet.lcsc.com/lcsc/2201121430_FOJAN-FRC0402F2430TS_C2929995.pdf; ComponentLink1Description: Datasheet; Package: 0402; Part Status: Active; Resistance: 243R
R?#18 R?#19 = WR04X2001FTL: as R?#1 on sheet DDR3; Part Number: WR04X2001FTL; ComponentLink1URL: https://datasheet.lcsc.com/lcsc/1810191630_Walsin-Tech-Corp-WR04X2001FTL_C163822.pdf; ComponentLink1Description: Datasheet; Package: 0402; Part Status: Active; Resistance: 2k
U?#3-U?#19 = Allwinner A33: Manufacturer: Allwinner Technology Co., Ltd.; Part Number: Allwinner A33; ComponentLink1URL: http://dl.linux-sunxi.org/A33/A33%20Datasheet%20release%201.1.pdf; ComponentLink1Description: Datasheet; ComponentLink2URL: http://dl.linux-sunxi.org/A33/A33%20user%20manual%20release%201.1.pdf; ComponentLink2Description: User manual; Package: BGA-282; Part Status: Active

## Sheet USB HUB FE1.1.SchDoc
size A4; SheetNumber: 10; SheetTotal: 12
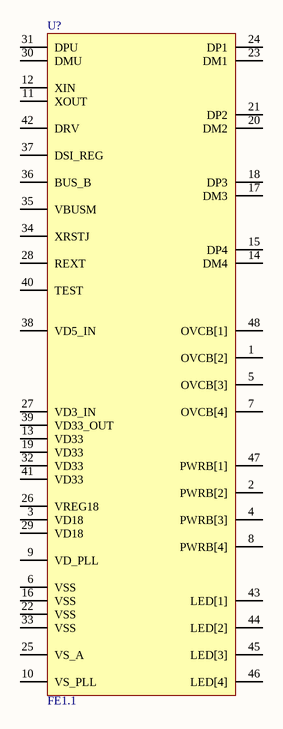
[diagram p5: USB HUB FE1.1.SchDoc]

### Parts
(Parts that share a designator on the sheet are numbered #1, #2 ... from top to bottom, then left to right.)
U?#20  FE1.1  [TSQFP50P900X900X160-48N]

### Nets

Not connected (* = marked no-connect by the designer): U?#20 1(OVCB[2]) 2(PWRB[2]) 3(VD18) 4(PWRB[3]) 5(OVCB[3]) 6(VSS) 7(OVCB[4]) 8(PWRB[4]) 9(VD_PLL) 10(VS_PLL) 11(XOUT) 12(XIN) 13(VD33) 14(DM4) 15(DP4) 16(VSS) 17(DM3) 18(DP3) 19(VD33) 20(DM2) 21(DP2) 22(VSS) 23(DM1) 24(DP1) 25(VS_A) 26(VREG18) 27(VD3_IN) 28(REXT) 29(VD18) 30(DMU) 31(DPU) 32(VD33) 33(VSS) 34(XRSTJ) 35(VBUSM) 36(BUS_B) 37(DSI_REG) 38(VD5_IN) 39(VD33_OUT) 40(TEST) 41(VD33) 42(DRV) 43(LED[1]) 44(LED[2]) 45(LED[3]) 46(LED[4]) 47(PWRB[1]) 48(OVCB[1])

### Library data of the parts
U?#20 = FE1.1: MANUFACTURER: Terminus Tech; Part Number: FE1.1; COMPONENTLINK1URL: https://datasheet.lcsc.com/lcsc/2303171730_Terminus-Tech-FE1-1S-BSOP28BCN_C9359.pdf; COMPONENTLINK1DESCRIPTION: Datasheet; PACKAGE: LQFP-48(7x7); Part Status: Active

## Sheet USB-Ethernet 100M SR9900A.SchDoc
size A4; SheetNumber: 11; SheetTotal: 11
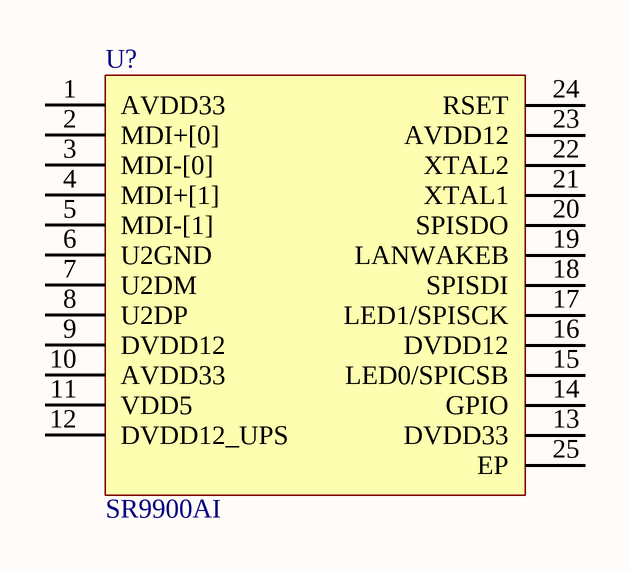
[diagram p6: USB-Ethernet 100M SR9900A.SchDoc]

### Parts
(Parts that share a designator on the sheet are numbered #1, #2 ... from top to bottom, then left to right.)
U?#21  SR9900AI  [QFN50P400X400X80_HS-25N]

### Nets

Not connected (* = marked no-connect by the designer): U?#21 1(AVDD33) 2(MDI+[0]) 3(MDI-[0]) 4(MDI+[1]) 5(MDI-[1]) 6(U2GND) 7(U2DM) 8(U2DP) 9(DVDD12) 10(AVDD33) 11(VDD5) 12(DVDD12_UPS) 13(DVDD33) 14(GPIO) 15(LED0/SPICSB) 16(DVDD12) 17(LED1/SPISCK) 18(SPISDI) 19(LANWAKEB) 20(SPISDO) 21(XTAL1) 22(XTAL2) 23(AVDD12) 24(RSET) 25(EP)

### Library data of the parts
U?#21 = SR9900AI: MANUFACTURER: CoreChips; Part Number: SR9900AI; COMPONENTLINK1URL: https://datasheet.lcsc.com/lcsc/2202082100_CoreChips-SR9900A_C521278.pdf; COMPONENTLINK1DESCRIPTION: Datasheet; PACKAGE: QFN-24EP; Part Status: Active

## Sheet MCU HC32F460KETA.SchDoc
size A4; SheetNumber: 12; SheetTotal: 12
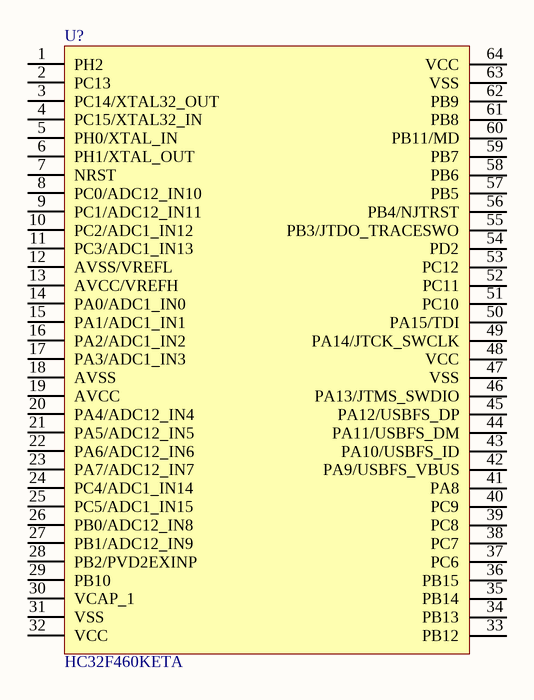
[diagram p7: MCU HC32F460KETA.SchDoc]

### Parts
(Parts that share a designator on the sheet are numbered #1, #2 ... from top to bottom, then left to right.)
U?#22  HC32F460KETA  [TSQFP50P1200X1200X160-64N]

### Nets

Not connected (* = marked no-connect by the designer): U?#22 1(PH2) 2(PC13) 3(PC14/XTAL32_OUT) 4(PC15/XTAL32_IN) 5(PH0/XTAL_IN) 6(PH1/XTAL_OUT) 7(NRST) 8(PC0/ADC12_IN10) 9(PC1/ADC12_IN11) 10(PC2/ADC1_IN12) 11(PC3/ADC1_IN13) 12(AVSS/VREFL) 13(AVCC/VREFH) 14(PA0/ADC1_IN0) 15(PA1/ADC1_IN1) 16(PA2/ADC1_IN2) 17(PA3/ADC1_IN3) 18(AVSS) 19(AVCC) 20(PA4/ADC12_IN4) 21(PA5/ADC12_IN5) 22(PA6/ADC12_IN6) 23(PA7/ADC12_IN7) 24(PC4/ADC1_IN14) 25(PC5/ADC1_IN15) 26(PB0/ADC12_IN8) 27(PB1/ADC12_IN9) 28(PB2/PVD2EXINP) 29(PB10) 30(VCAP_1) 31(VSS) 32(VCC) 33(PB12) 34(PB13) 35(PB14) 36(PB15) 37(PC6) 38(PC7) 39(PC8) 40(PC9) 41(PA8) 42(PA9/USBFS_VBUS) 43(PA10/USBFS_ID) 44(PA11/USBFS_DM) 45(PA12/USBFS_DP) 46(PA13/JTMS_SWDIO) 47(VSS) 48(VCC) 49(PA14/JTCK_SWCLK) 50(PA15/TDI) 51(PC10) 52(PC11) 53(PC12) 54(PD2) 55(PB3/JTDO_TRACESWO) 56(PB4/NJTRST) 57(PB5) 58(PB6) 59(PB7) 60(PB11/MD) 61(PB8) 62(PB9) 63(VSS) 64(VCC)

### Library data of the parts
U?#22 = HC32F460KETA: Manufacturer: XHSC; Part Number: HC32F460KETA; ComponentLink1URL: https://datasheet.lcsc.com/lcsc/2206131716_XHSC-HC32F460KETA-LQFP64_C784659.pdf; ComponentLink1Description: Datasheet; Package: LQFP-64; Part Status: Active

## Nets that join several sheets
1V5: DDR3 (55 pins), MPU Allwinner A33 (13 pins)
3V0: Micro SD (8 pins), NAND flash (C?#32.1 C?#33.1 U3.12 U3.37)
GND: DDR3 (68 pins), Micro SD (6 pins), MPU Allwinner A33 (53 pins)
S0BA0: DDR3 (U?#1.J2 U?#2.J2), MPU Allwinner A33 (U?#7.J3)
S0BA1: DDR3 (U?#1.K8 U?#2.K8), MPU Allwinner A33 (U?#7.K4)
S0BA2: DDR3 (U?#1.J3 U?#2.J3), MPU Allwinner A33 (U?#7.H4)
S0CASN: DDR3 (U?#1.G3 U?#2.G3), MPU Allwinner A33 (U?#7.M3)
S0CKE0: DDR3 (U?#1.G9 U?#2.G9), MPU Allwinner A33 (U?#7.J4)
S0CLK: DDR3 (R?#4.1 U?#1.F7 U?#2.F7), MPU Allwinner A33 (R?#15.1)
S0CLKN: DDR3 (R?#4.2 U?#1.G7 U?#2.G7), MPU Allwinner A33 (R?#16.1)
S0DDR3_RST: DDR3 (R?#3.1 U?#1.N2 U?#2.N2), MPU Allwinner A33 (U?#7.G3)
S0DQ0: DDR3 (U?#1.E8), MPU Allwinner A33 (U?#7.M1)
S0DQ1: DDR3 (U?#1.C8), MPU Allwinner A33 (U?#7.M2)
S0DQ2: DDR3 (U?#1.C7), MPU Allwinner A33 (U?#7.L1)
S0DQ3: DDR3 (U?#1.E7), MPU Allwinner A33 (U?#7.L2)
S0DQ4: DDR3 (U?#1.E3), MPU Allwinner A33 (U?#7.J1)
S0DQ5: DDR3 (U?#1.B3), MPU Allwinner A33 (U?#7.J2)
S0DQ6: DDR3 (U?#1.D2), MPU Allwinner A33 (U?#7.H1)
S0DQ7: DDR3 (U?#1.C2), MPU Allwinner A33 (U?#7.H2)
S0DQ8: DDR3 (U?#2.C8), MPU Allwinner A33 (U?#7.U3)
S0DQ9: DDR3 (U?#2.E8), MPU Allwinner A33 (U?#7.U1)
S0DQ10: DDR3 (U?#2.C7), MPU Allwinner A33 (U?#7.U2)
S0DQ11: DDR3 (U?#2.E7), MPU Allwinner A33 (U?#7.T2)
S0DQ12: DDR3 (U?#2.E3), MPU Allwinner A33 (U?#7.R2)
S0DQ13: DDR3 (U?#2.B3), MPU Allwinner A33 (U?#7.P1)
S0DQ14: DDR3 (U?#2.C2), MPU Allwinner A33 (U?#7.P2)
S0DQ15: DDR3 (U?#2.D2), MPU Allwinner A33 (U?#7.N1)
S0ODT0: DDR3 (U?#1.G1 U?#2.G1), MPU Allwinner A33 (U?#7.L3)
S0ODT1: DDR3 (U?#1.F1 U?#2.F1), MPU Allwinner A33 (U?#7.L7)
S0RASN: DDR3 (U?#1.F3 U?#2.F3), MPU Allwinner A33 (U?#7.L4)
S0SA0: DDR3 (U?#1.K3 U?#2.K3), MPU Allwinner A33 (U?#7.E4)
S0SA1: DDR3 (U?#1.L7 U?#2.L7), MPU Allwinner A33 (U?#7.D1)
S0SA2: DDR3 (U?#1.L3 U?#2.L3), MPU Allwinner A33 (U?#7.F2)
S0SA3: DDR3 (U?#1.K2 U?#2.K2), MPU Allwinner A33 (U?#7.H3)
S0SA4: DDR3 (U?#1.L8 U?#2.L8), MPU Allwinner A33 (U?#7.D2)
S0SA5: DDR3 (U?#1.L2 U?#2.L2), MPU Allwinner A33 (U?#7.F1)
S0SA6: DDR3 (U?#1.M8 U?#2.M8), MPU Allwinner A33 (U?#7.A1)
S0SA7: DDR3 (U?#1.M2 U?#2.M2), MPU Allwinner A33 (U?#7.G4)
S0SA8: DDR3 (U?#1.N8 U?#2.N8), MPU Allwinner A33 (U?#7.B1)
S0SA9: DDR3 (U?#1.M3 U?#2.M3), MPU Allwinner A33 (U?#7.F4)
S0SA10: DDR3 (U?#1.H7 U?#2.H7), MPU Allwinner A33 (U?#7.E2)
S0SA11: DDR3 (U?#1.M7 U?#2.M7), MPU Allwinner A33 (U?#7.C2)
S0SA12: DDR3 (U?#1.K7 U?#2.K7), MPU Allwinner A33 (U?#7.E1)
S0SA13: DDR3 (U?#1.N3 U?#2.N3), MPU Allwinner A33 (U?#7.F3)
S0SA14: DDR3 (U?#1.N7 U?#2.N7), MPU Allwinner A33 (U?#7.C1)
S0SA15: DDR3 (U?#1.J7 U?#2.J7), MPU Allwinner A33 (U?#7.E3)
S0SCS0: DDR3 (U?#1.H2 U?#2.H2), MPU Allwinner A33 (U?#7.N3)
S0SDQM0: DDR3 (U?#1.B7), MPU Allwinner A33 (U?#7.N2)
S0SDQM1: DDR3 (U?#2.B7), MPU Allwinner A33 (U?#7.T3)
S0SDQS0: DDR3 (U?#1.C3), MPU Allwinner A33 (U?#7.K2)
S0SDQS0_N: DDR3 (U?#1.D3), MPU Allwinner A33 (U?#7.K1)
S0SDQS1: DDR3 (U?#2.C3), MPU Allwinner A33 (U?#7.R1)
S0SDQS1_N: DDR3 (U?#2.D3), MPU Allwinner A33 (U?#7.T1)
S0WEN: DDR3 (U?#1.H3 U?#2.H3), MPU Allwinner A33 (U?#7.K3)

## Assembly variants
Assembly: not fitted R? R? R?